# Altium schematic sheet Display.SchDoc
size A4
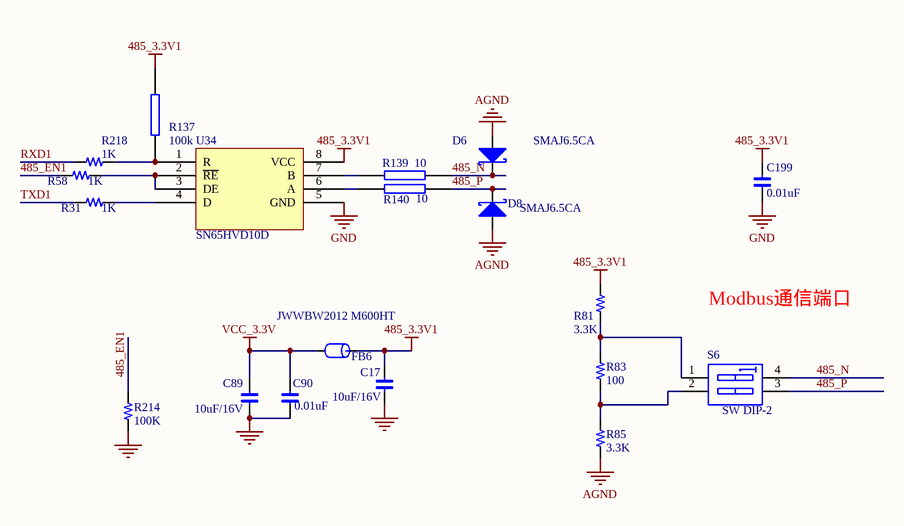
[diagram p0: Display.SchDoc]

## Parts
C17  10uF/16V  [0805C]
C89  10uF/16V  [0805C]
C90  0.01uF  [0603C]
C199  0.01uF  [0603C]
D6  SMAJ6.5CA  [SMA]
D8  SMAJ6.5CA  [SMA]
FB6  JWWBW2012 M600HT  [0805CZ]
R31  1K  [0603R]
R58  1K  [0603R]
R81  3.3K  [0603R]
R83  100  [0603R]
R85  3.3K  [0603R]
R137  100k  [0603R]
R139  10  [1206R]
R140  10  [1206R]
R214  100K  [0603R]
R218  1K  [0603R]
S6  SW DIP-2  [DIP-4]
U34  SN65HVD10D  [so-8]

## Nets
485_3.3V1: C17.2 C199.2 FB6.1 R81.2 R137.2 U34.8(VCC)
AGND: D6.A D8.A R85.1
GND: C17.1 C89.1 C90.1 C199.1 R214.1 U34.5(GND)
VCC_3.3V: C89.2 C90.2 FB6.2
485_EN1: R58.2 R214.2
485_N: D6.K R139.1 S6.4(B1)
485_P: D8.K R140.1 S6.3(B2)
RXD1: R218.2
TXD1: R31.2
NetR31_1: R31.1 U34.4(D)
NetR58_1: R58.1 U34.2(~{RE}) U34.3(DE)
NetR81_1: R81.1 R83.2 S6.1(A1)
NetR83_1: R83.1 R85.2 S6.2(A2)
NetR137_1: R137.1 R218.1 U34.1(R)
NetR139_2: R139.2 U34.7(B)
NetR140_2: R140.2 U34.6(A)

## Notes on the sheet
- Modbus通信端口

## Library data of the parts
C17 C89 C90 C199 = C
D6 D8 = DIODE S: Schottky Diode
FB6 = FB: Part Field 1: 磁珠/0603/1K ohm/100MHz; FB: BLM18BD102SN1(muRata); Text Field1: FB
R31 R58 R81 R83 R85 R214 R218 = R
R137 R139 R140 = RES2
S6 = SW DIP-2: DIP Switch, 2 Position, SPST; Published: 24-Mar-1999; LatestRevisionDate: 17-Jul-2002; LatestRevisionNote: Re-released for DXP Platform.; PackageReference: DIP-4; Publisher: Altium Limited
U34 = SN65HVD06D